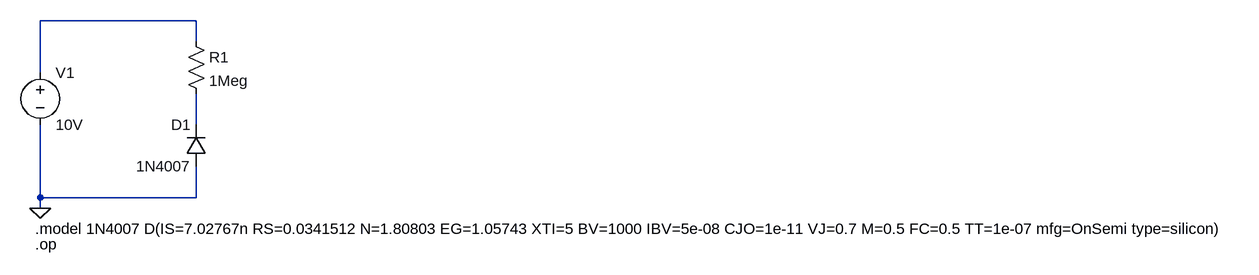
[diagram p0: schematic 1n4007_sample.asc]
1n4007_sample.asc, the LTspice schematic file:
Version 4
SHEET 1 2232 680
WIRE 224 -208 -16 -208
WIRE 224 -176 224 -208
WIRE -16 -128 -16 -208
WIRE 224 -48 224 -96
WIRE -16 64 -16 -48
WIRE 224 64 224 16
WIRE 224 64 -16 64
WIRE -16 80 -16 64
FLAG -16 80 0
SYMBOL diode 240 16 R180
WINDOW 0 24 64 Left 2
WINDOW 3 24 0 Left 2
SYMATTR InstName D1
SYMATTR Value 1N4007
SYMBOL res 208 -192 R0
SYMATTR InstName R1
SYMATTR Value 1Meg
SYMBOL voltage -16 -144 R0
WINDOW 123 0 0 Left 0
WINDOW 39 0 0 Left 0
SYMATTR InstName V1
SYMATTR Value 10V
TEXT -24 112 Left 2 !.model 1N4007 D(IS=7.02767n RS=0.0341512 N=1.80803 EG=1.05743 XTI=5 BV=1000 IBV=5e-08 CJO=1e-11 VJ=0.7 M=0.5 FC=0.5 TT=1e-07 mfg=OnSemi type=silicon)
TEXT -24 136 Left 2 !.op

The netlist it stands for:
* 1n4007_sample.asc
D1 0 N002 1N4007
R1 N001 N002 1Meg
V1 N001 0 10V
.model D D
.lib standard.dio
.model 1N4007 D(IS=7.02767n RS=0.0341512 N=1.80803 EG=1.05743 XTI=5 BV=1000 IBV=5e-08 CJO=1e-11 VJ=0.7 M=0.5 FC=0.5 TT=1e-07 mfg=OnSemi type=silicon)
.op
.backanno
.end